# Altium project usbc-test-v1.PrjPcb
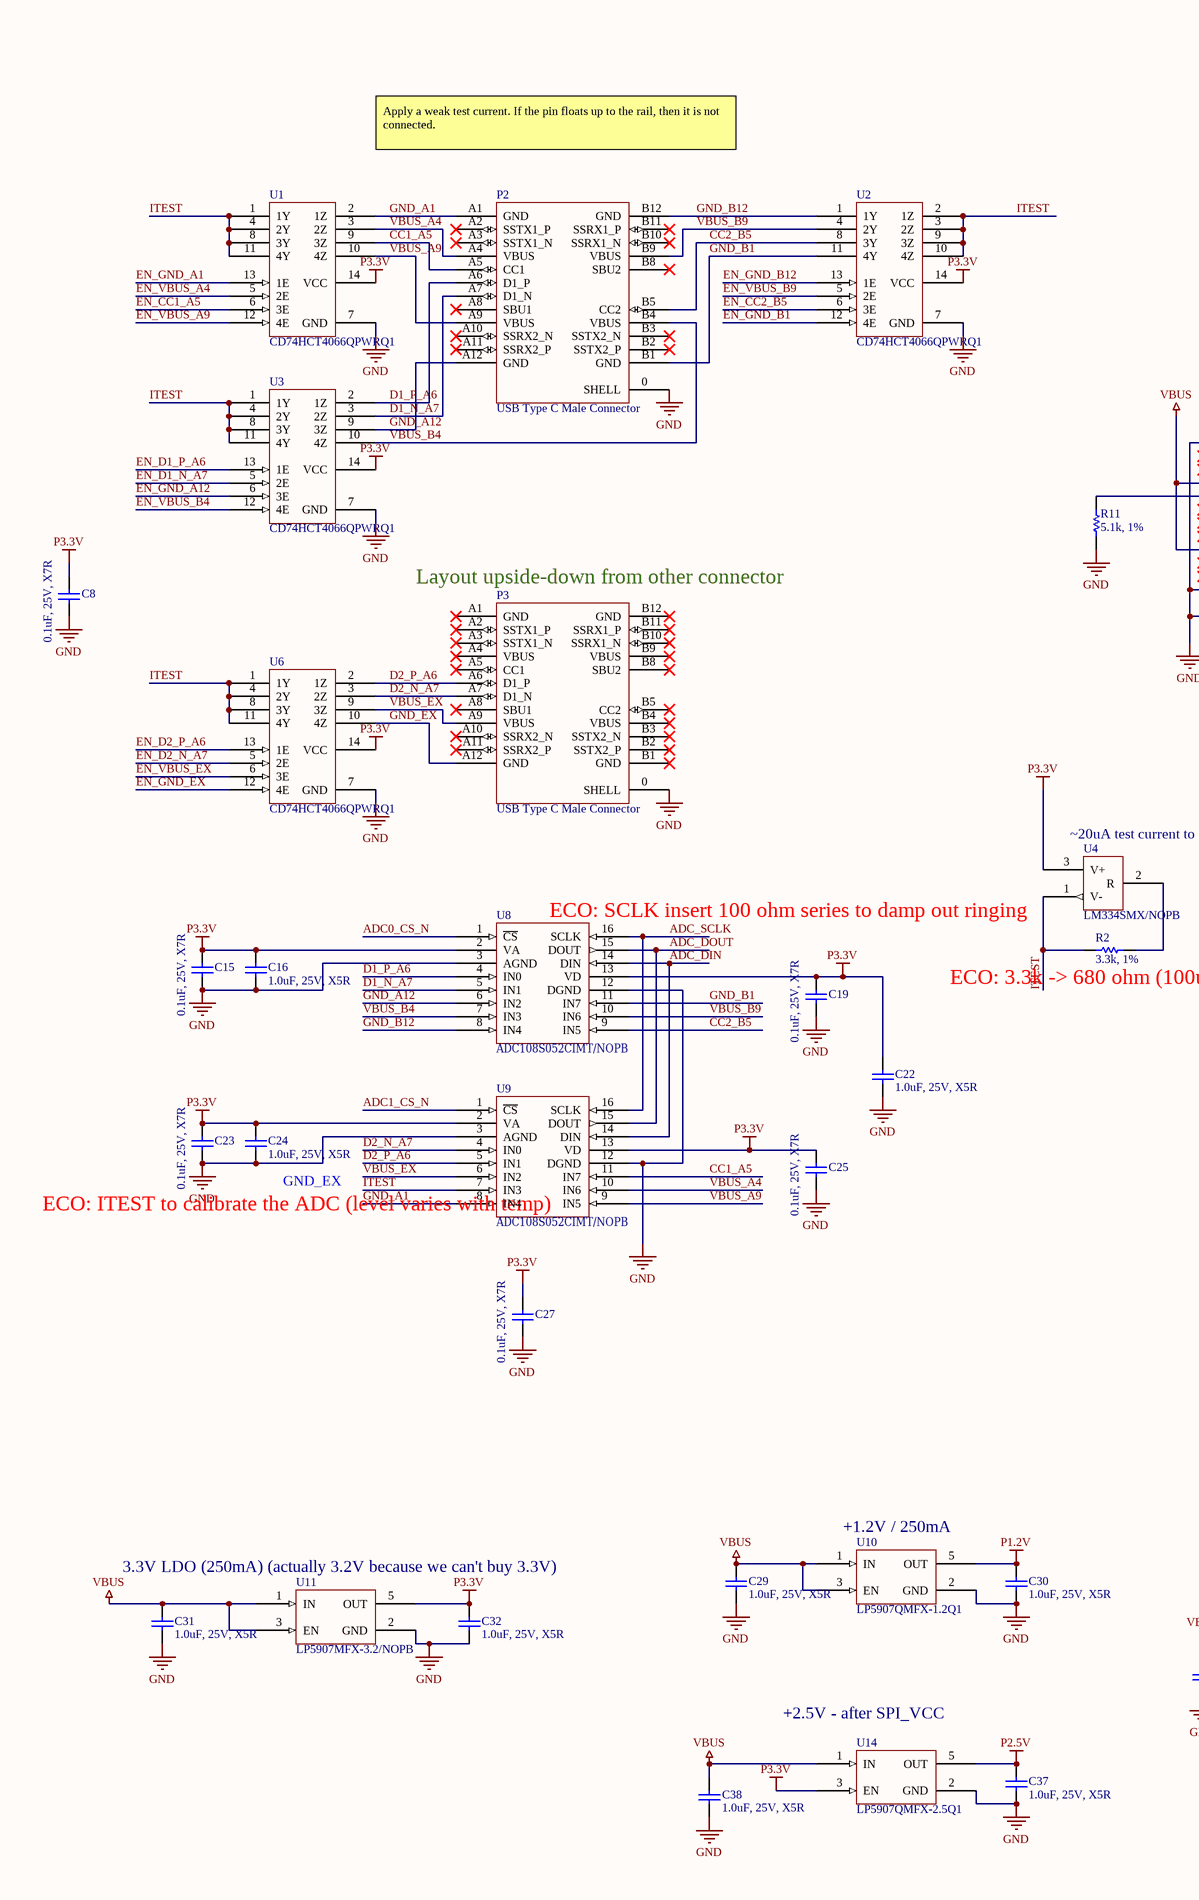
[diagram p0: tester.SchDoc, left]
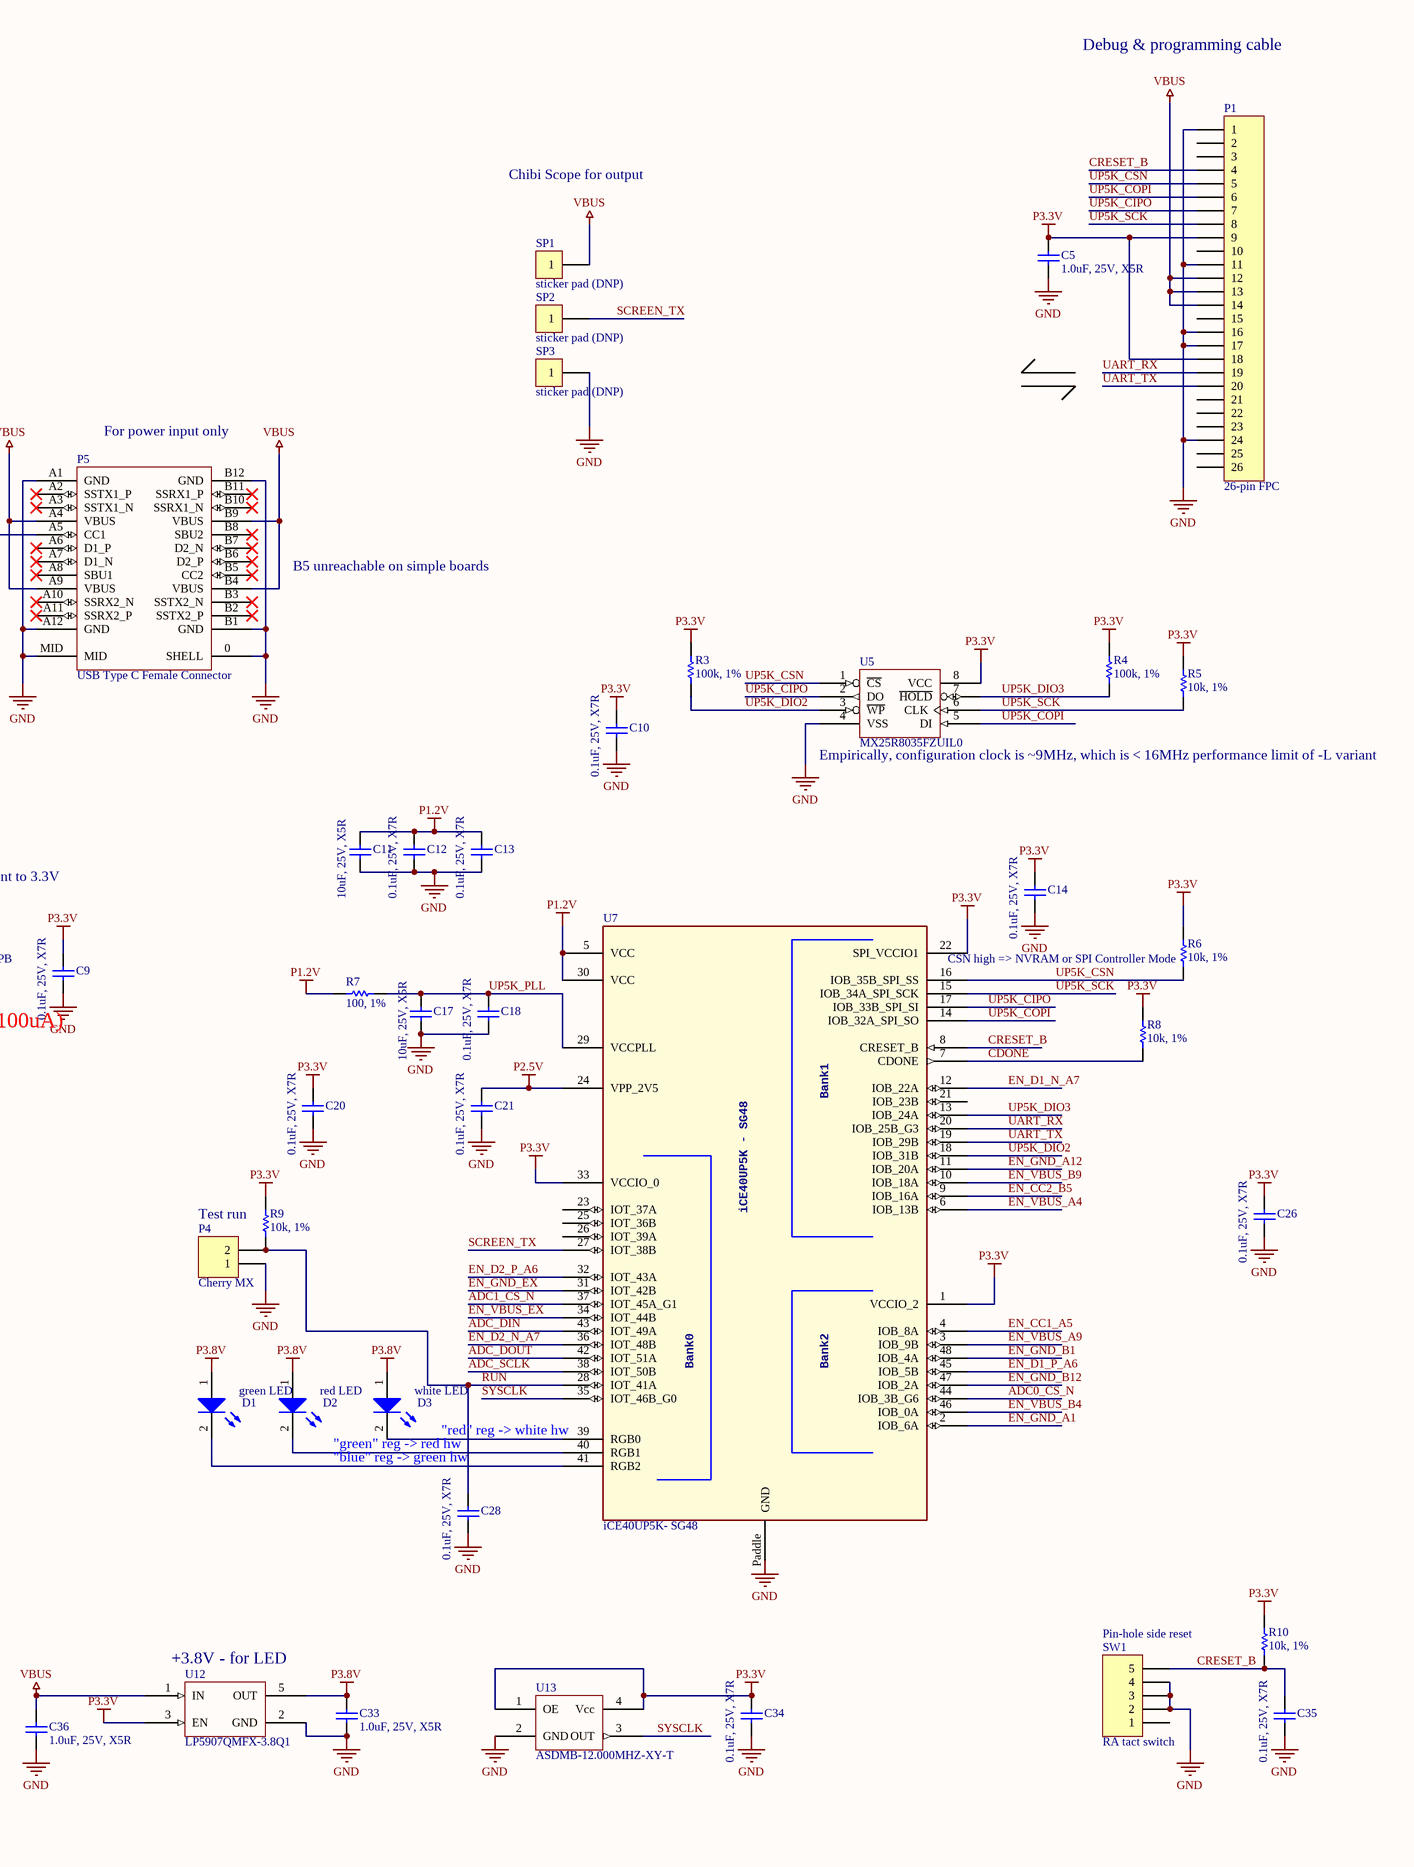
[diagram p1: tester.SchDoc, right]
1 sheet, 68 parts. Net scope: global (net labels, ports and power ports of the same name join across sheets).
Board file: usbc-test-v1.PcbDoc

## Sheet tester.SchDoc
size C; SheetNumber: 1; SheetTotal: 1

### Parts
C5  1.0uF, 25V, X5R  [B_CAP0603]
C8  0.1uF, 25V, X7R  [B_CAP0603]
C9  0.1uF, 25V, X7R  [B_CAP0603]
C10  0.1uF, 25V, X7R  [B_CAP0603]
C11  10uF, 25V, X5R  [B_CAP0805]
C12  0.1uF, 25V, X7R  [B_CAP0603]
C13  0.1uF, 25V, X7R  [B_CAP0603]
C14  0.1uF, 25V, X7R  [B_CAP0603]
C15  0.1uF, 25V, X7R  [B_CAP0603]
C16  1.0uF, 25V, X5R  [B_CAP0603]
C17  10uF, 25V, X5R  [B_CAP0805]
C18  0.1uF, 25V, X7R  [B_CAP0603]
C19  0.1uF, 25V, X7R  [B_CAP0603]
C20  0.1uF, 25V, X7R  [B_CAP0603]
C21  0.1uF, 25V, X7R  [B_CAP0603]
C22  1.0uF, 25V, X5R  [B_CAP0603]
C23  0.1uF, 25V, X7R  [B_CAP0603]
C24  1.0uF, 25V, X5R  [B_CAP0603]
C25  0.1uF, 25V, X7R  [B_CAP0603]
C26  0.1uF, 25V, X7R  [B_CAP0603]
C27  0.1uF, 25V, X7R  [B_CAP0603]
C28  0.1uF, 25V, X7R  [B_CAP0603]
C29  1.0uF, 25V, X5R  [B_CAP0603]
C30  1.0uF, 25V, X5R  [B_CAP0603]
C31  1.0uF, 25V, X5R  [B_CAP0603]
C32  1.0uF, 25V, X5R  [B_CAP0603]
C33  1.0uF, 25V, X5R  [B_CAP0603]
C34  0.1uF, 25V, X7R  [B_CAP0603]
C35  0.1uF, 25V, X7R  [B_CAP0603]
C36  1.0uF, 25V, X5R  [B_CAP0603]
C37  1.0uF, 25V, X5R  [B_CAP0603]
C38  1.0uF, 25V, X5R  [B_CAP0603]
D1  green LED  [B_LED0805]
D2  red LED  [B_LED0805]
D3  white LED  [B_LED0805]
P1  26-pin FPC  [HRS_FH34SRJ-26S-0.5SH(50)]
P2  USB Type C Male Connector  [MOLEX_1054440001]
P3  USB Type C Male Connector  [MOLEX_1054440001]
P4  Cherry MX  [CHERRY_MX_BASIC]
P5  USB Type C Female Connector  [TE_1-2295018-2]
R2  3.3k, 1%  [B_RES0402]
R3  100k, 1%  [B_RES0603]
R4  100k, 1%  [B_RES0603]
R5  10k, 1%  [B_RES0603]
R6  10k, 1%  [B_RES0603]
R7  100, 1%  [B_RES0603]
R8  10k, 1%  [B_RES0603]
R9  10k, 1%  [B_RES0603]
R10  10k, 1%  [B_RES0603]
R11  5.1k, 1%  [B_RES0603]
SP1  sticker pad (DNP)  [TP_SMT_38mil]
SP2  sticker pad (DNP)  [TP_SMT_38mil]
SP3  sticker pad (DNP)  [TP_SMT_38mil]
SW1  RA tact switch  [CK_KMS221GPLFS]
U1  CD74HCT4066QPWRQ1  [TSOP65P640-14AN]
U2  CD74HCT4066QPWRQ1  [TSOP65P640-14AN]
U3  CD74HCT4066QPWRQ1  [TSOP65P640-14AN]
U4  LM334SMX/NOPB  [SOIC127P600-8AN]
U5  MX25R8035FZUIL0  [USON-8]
U6  CD74HCT4066QPWRQ1  [TSOP65P640-14AN]
U7  iCE40UP5K- SG48  [UP5K_QFN127P600-8N]
U8  ADC108S052CIMT/NOPB‎  [SOP65P640-16N]
U9  ADC108S052CIMT/NOPB‎  [SOP65P640-16N]
U10  LP5907QMFX-1.2Q1  [SOT23-5AN]
U11  LP5907MFX-3.2/NOPB  [SOT23-5AN]
U12  LP5907QMFX-3.8Q1  [SOT23-5AN]
U13  ASDMB-12.000MHZ-XY-T  [ABRACON_ASDMB]
U14  LP5907QMFX-2.5Q1  [SOT23-5AN]

### Nets
GND: C5.1 C8.2 C9.2 C10.2 C11.2 C12.2 C13.2 C14.2 C15.2 C16.1 C17.2 C18.2 C19.2 C20.2 C21.2 C22.1 C23.2 C24.1 C25.2 C26.2 C27.2 C28.2 C29.1 C30.1 C31.1 C32.1 C33.1 C34.2 C35.2 C36.1 C37.1 C38.1 P1.1 P1.11 P1.16 P1.17 P1.24 P2.0(SHELL) P3.0(SHELL) P4.1 P5.0(SHELL) P5.A1(GND) P5.A12(GND) P5.B1(GND) P5.B12(GND) P5.MID R11.1 SP3.1 SW1.2 SW1.3 SW1.4 U1.7(GND) U2.7(GND) U3.7(GND) U5.4(VSS) U6.7(GND) U7.Paddle(GND) U8.3(AGND) U8.12(DGND) U9.3(AGND) U9.12(DGND) U10.2(GND) U11.2(GND) U12.2(GND) U13.2(GND) U14.2(GND)
P1.2V: C11.1 C12.1 C13.1 C30.2 R7.1 U7.5(VCC) U7.30(VCC) U10.5(OUT)
P2.5V: C21.1 C37.2 U7.24(VPP_2V5) U14.5(OUT)
P3.3V: C5.2 C8.1 C9.1 C10.1 C14.1 C15.1 C16.2 C19.1 C20.1 C22.2 C23.1 C24.2 C25.1 C26.1 C27.1 C32.2 C34.1 P1.9 P1.18 R3.1 R4.1 R5.1 R6.1 R8.1 R9.1 R10.1 U1.14(VCC) U2.14(VCC) U3.14(VCC) U4.3(V+) U5.8(VCC) U6.14(VCC) U7.1(VCCIO_2) U7.22(SPI_VCCIO1) U7.33(VCCIO_0) U8.2(VA) U8.13(VD) U9.2(VA) U9.13(VD) U11.5(OUT) U12.3(EN) U13.1(OE) U13.4(Vcc) U14.3(EN)
P3.8V: C33.2 D1.1(A) D2.1(A) D3.1(A) U12.5(OUT)
VBUS: C29.2 C31.2 C36.2 C38.2 P1.12 P1.13 P1.14 P5.A4(VBUS) P5.A9(VBUS) P5.B4(VBUS) P5.B9(VBUS) SP1.1 U10.1(IN) U10.3(EN) U11.1(IN) U11.3(EN) U12.1(IN) U14.1(IN)
ADC0_CS_N: U7.44(IOB_3B_G6) U8.1(~{CS})
ADC1_CS_N: U7.37(IOT_45A_G1) U9.1(~{CS})
ADC_DIN: U7.43(IOT_49A) U8.14(DIN) U9.14(DIN)
ADC_DOUT: U7.42(IOT_51A) U8.15(DOUT) U9.15(DOUT)
ADC_SCLK: U7.38(IOT_50B) U8.16(SCLK) U9.16(SCLK)
CC1_A5: P2.A5(CC1) U1.9(3Z) U9.11(IN7)
CC2_B5: P2.B5(CC2) U2.8(3Y) U8.9(IN5)
CDONE: R8.2 U7.7(CDONE)
CRESET_B: C35.1 P1.4 R10.2 SW1.5 U7.8(CRESET_B)
D1_N_A7: P2.A7(D1_N) U3.3(2Z) U8.5(IN1)
D1_P_A6: P2.A6(D1_P) U3.2(1Z) U8.4(IN0)
D2_N_A7: P3.A7(D1_N) U6.3(2Z) U9.4(IN0)
D2_P_A6: P3.A6(D1_P) U6.2(1Z) U9.5(IN1)
EN_CC1_A5: U1.6(3E) U7.4(IOB_8A)
EN_CC2_B5: U2.6(3E) U7.9(IOB_16A)
EN_D1_N_A7: U3.5(2E) U7.12(IOB_22A)
EN_D1_P_A6: U3.13(1E) U7.45(IOB_5B)
EN_D2_N_A7: U6.5(2E) U7.36(IOT_48B)
EN_D2_P_A6: U6.13(1E) U7.32(IOT_43A)
EN_GND_A1: U1.13(1E) U7.2(IOB_6A)
EN_GND_A12: U3.6(3E) U7.11(IOB_20A)
EN_GND_B1: U2.12(4E) U7.48(IOB_4A)
EN_GND_B12: U2.13(1E) U7.47(IOB_2A)
EN_GND_EX: U6.12(4E) U7.31(IOT_42B)
EN_VBUS_A4: U1.5(2E) U7.6(IOB_13B)
EN_VBUS_A9: U1.12(4E) U7.3(IOB_9B)
EN_VBUS_B4: U3.12(4E) U7.46(IOB_0A)
EN_VBUS_B9: U2.5(2E) U7.10(IOB_18A)
EN_VBUS_EX: U6.6(3E) U7.34(IOT_44B)
GND_A1: P2.A1(GND) U1.2(1Z) U9.8(IN4)
GND_A12: P2.A12(GND) U3.9(3Z) U8.6(IN2)
GND_B1: P2.B1(GND) U2.11(4Y) U8.11(IN7)
GND_B12: P2.B12(GND) U2.1(1Y) U8.8(IN4)
GND_EX: P3.A12(GND) U6.10(4Z)
ITEST: R2.1 U1.1(1Y) U1.4(2Y) U1.8(3Y) U1.11(4Y) U2.2(1Z) U2.3(2Z) U2.9(3Z) U2.10(4Z) U3.1(1Y) U3.4(2Y) U3.8(3Y) U3.11(4Y) U4.1(V-) U6.1(1Y) U6.4(2Y) U6.8(3Y) U6.11(4Y) U9.7(IN3)
RUN: C28.1 P4.2 R9.2 U7.28(IOT_41A)
SCREEN_TX: SP2.1 U7.27(IOT_38B)
SYSCLK: U7.35(IOT_46B_G0) U13.3(OUT)
UART_RX: P1.19 U7.20(IOB_25B_G3)
UART_TX: P1.20 U7.19(IOB_29B)
UP5K_CIPO: P1.7 U5.2(DO) U7.17(IOB_33B_SPI_SI)
UP5K_COPI: P1.6 U5.5(DI) U7.14(IOB_32A_SPI_SO)
UP5K_CSN: P1.5 R6.2 U5.1(~{CS}) U7.16(IOB_35B_SPI_SS)
UP5K_DIO2: R3.2 U5.3(~{WP}) U7.18(IOB_31B)
UP5K_DIO3: R4.2 U5.7(~{HOLD}) U7.13(IOB_24A)
UP5K_PLL: C17.1 C18.1 R7.2 U7.29(VCCPLL)
UP5K_SCK: P1.8 R5.2 U5.6(CLK) U7.15(IOB_34A_SPI_SCK)
VBUS_A4: P2.A4(VBUS) U1.3(2Z) U9.10(IN6)
VBUS_A9: P2.A9(VBUS) U1.10(4Z) U9.9(IN5)
VBUS_B4: P2.B4(VBUS) U3.10(4Z) U8.7(IN3)
VBUS_B9: P2.B9(VBUS) U2.4(2Y) U8.10(IN6)
VBUS_EX: P3.A9(VBUS) U6.9(3Z) U9.6(IN2)
NetD1_2: D1.2(K) U7.41(RGB2)
NetD2_2: D2.2(K) U7.40(RGB1)
NetD3_2: D3.2(K) U7.39(RGB0)
NetP5_A5: P5.A5(CC1) R11.2
NetR2_2: R2.2 U4.2(R)

Not connected (* = marked no-connect by the designer): P1 2 3 10 15 21 22 23 25 26; P2 A2(SSTX1_P)* A3(SSTX1_N)* A8(SBU1)* A10(SSRX2_N)* A11(SSRX2_P)* B2(SSTX2_P)* B3(SSTX2_N)* B8(SBU2)* B10(SSRX1_N)* B11(SSRX1_P)*; P3 A1(GND)* A2(SSTX1_P)* A3(SSTX1_N)* A4(VBUS)* A5(CC1)* A8(SBU1)* A10(SSRX2_N)* A11(SSRX2_P)* B1(GND)* B2(SSTX2_P)* B3(SSTX2_N)* B4(VBUS)* B5(CC2)* B8(SBU2)* B9(VBUS)* B10(SSRX1_N)* B11(SSRX1_P)* B12(GND)*; P5 A2(SSTX1_P)* A3(SSTX1_N)* A6(D1_P)* A7(D1_N)* A8(SBU1)* A10(SSRX2_N)* A11(SSRX2_P)* B2(SSTX2_P)* B3(SSTX2_N)* B5(CC2)* B6(D2_P)* B7(D2_N)* B8(SBU2)* B10(SSRX1_N)* B11(SSRX1_P)*; SW1 1; U7 21(IOB_23B) 23(IOT_37A) 25(IOT_36B) 26(IOT_39A)

### Notes on the sheet
- Debug & programming cable
- Apply a weak test current. If the pin floats up to the rail, then it is not connected.
- Chibi Scope for output
- (near P5) For power input only
- B5 unreachable on simple boards
- (near P3) Layout upside-down from other connector
- (near U5) Empirically, configuration clock is ~9MHz, which is < 16MHz performance limit of -L variant
- (near U4) ~20uA test current to 3.3V
- (near U4) ECO: SCLK insert 100 ohm series to damp out ringing
- (near R6) CSN high => NVRAM or SPI Controller Mode
- (near R2) ECO: 3.3k -> 680 ohm (100uA)
- (near U9) ECO: ITEST to calibrate the ADC (level varies with temp)
- (near C24) GND_EX
- (near R9) Test run
- (near D3) "green" reg -> red hw
- "blue" reg -> green hw
- (near U7) "red" reg -> white hw
- (near U10) +1.2V / 250mA
- 3.3V LDO (250mA) (actually 3.2V because we can't buy 3.3V)
- (near U12) +3.8V - for LED
- (near SW1) Pin-hole side reset
- (near U14) +2.5V - after SPI_VCC
- (in symbol iCE40UP5K- SG48) Bank1; iCE40UP5K - SG48; Bank0; Bank2

### Library data of the parts
C5 C16 C22 C24 C29-C33 C36-C38 = Cap Semi: Capacitor (Semiconductor SIM Model); MPN: CL10A105KA8NNNC; VENDOR: Samsung; MYPN: C-105-25-X5R-0603
C8-C10 C12-C15 C18-C21 C23 C25-C28 C34 C35 = Cap Semi: Capacitor (Semiconductor SIM Model); MPN: CC0603KRX7R8BB104; VENDOR: Murata; MYPN: C-104-25-X7R-0603
C11 C17 = Cap Semi: Capacitor (Semiconductor SIM Model); MPN: GRM21BR61E106KA73L; VENDOR: Murata; MYPN: C-106-25-X5R-0805
D1 = LED2: Typical RED, GREEN, YELLOW, AMBER GaAs LED; MPN: IN-S85ATG; VENDOR: Inolux; MYPN: D-LED-GREEN1-0805
D2 = LED2: Typical RED, GREEN, YELLOW, AMBER GaAs LED; MPN: IN-S85ATR; VENDOR: Inolux; MYPN: D-LED-RED1-0805
D3 = LED2: Typical RED, GREEN, YELLOW, AMBER GaAs LED; MPN: IN-S85AT5UW; VENDOR: Inolux; MYPN: D-LED-WHITE1-0805
P1 = FPC-26: 26 Pin FPC header; MPN: FH34SRJ-26S-0.5SH(99); MYPN: J-FPC-0.5mm-26-0.3mm-T/B; VENDOR: Hirose
P2 P3 = USB_TYPE_C: USB Type C Connector; MPN: 1054440011; VENDOR: Molex; MYPN: P-1054440001
P4 = Header 2: Header, 2-Pin; MPN: MX1A-E1NN; MYPN: SW-EVQ-P6DB35; LatestRevisionDate: 17-Jul-2002; LatestRevisionNote: Re-released for DXP Platform.; Publisher: Altium Limited; VENDOR: Cherry
P5 = USB_TYPE_C: USB Type C Connector; MPN: 1-2295018-2; VENDOR: TE Connectivity AMP Connectors; MYPN: P-1-2295018-2
R2 = Res1: Resistor; MPN: TBD; VENDOR: Yageo; MYPN: R-332-1P-1_16W-0402
R3 R4 = Res1: Resistor; MPN: TBD; VENDOR: Yageo; MYPN: R-104-1P-1_16W-0603
R5 R6 R8-R10 = Res1: Resistor; MPN: RC0603FR-0710KL; VENDOR: Yageo; MYPN: R-103-1P-1_16W-0603
R7 = Res1: Resistor; MPN: TBD; VENDOR: Yageo; MYPN: R-101-1P-1_16W-0603
R11 = Res1: Resistor; MPN: RC0603FR-075K1L; VENDOR: Yageo; MYPN: R-512-1P-1_16W-0603
SP1-SP3 = CON1: Connector
SW1 = Header 5: MPN: KMS221GPLFS; VENDOR: C&K; MYPN: SW-KMS221GPLFS; LatestRevisionDate: 17-Jul-2002; LatestRevisionNote: Re-released for DXP Platform.; Publisher: Altium Limited
U1-U3 U6 = 74HC4066: 4-channel analog mux; VENDOR: TI; MPN: CD74HCT4066QPWRQ1
U4 = LMx34: LM134/234/334 3-terminal adjustable current sources; VENDOR: TI; MPN: LM334SMX/NOPB
U5 = EN25P05-50GCP: 64Mbit SPI NOR FLASH; MYPN: UMX25R8035FZUIL0; VENDOR: Macronix; MPN: MX25R8035FZUIL0
U7 = iCE40UP5K- SG48: MPN: ICE40UP5K-SG48I; MYPN: U-ICE40UP5K-SG48I; VENDOR: Lattice
U8 U9 = ADCxx8Sxx2: 12-input SPI ADC, bits & sample rate pin compatible across family; MPN: ADC088S022CIMT/NOPB-ND; VENDOR: TI
U10-U12 U14 = LP5907QMFX-XX: Ultra low-noise 250mA LDO for RF and analog in SOT23-5; MPN: LP5907UVX-#.#/NOPB; VENDOR: TI; MYPN: ULP5907UVX-#.#/NOPB
U13 = OSCILLATOR: Abracon ASDMB Miniature Oscillator; VENDOR: Abracon LLC; MYPN: U-ASDMB-12MHz; MPN: ASDMB-12.000MHZ-XY-T